# Altium schematic sheet MOTOR_CONTROL.SchDoc
size A2; SheetNumber: 13; SheetTotal: 16
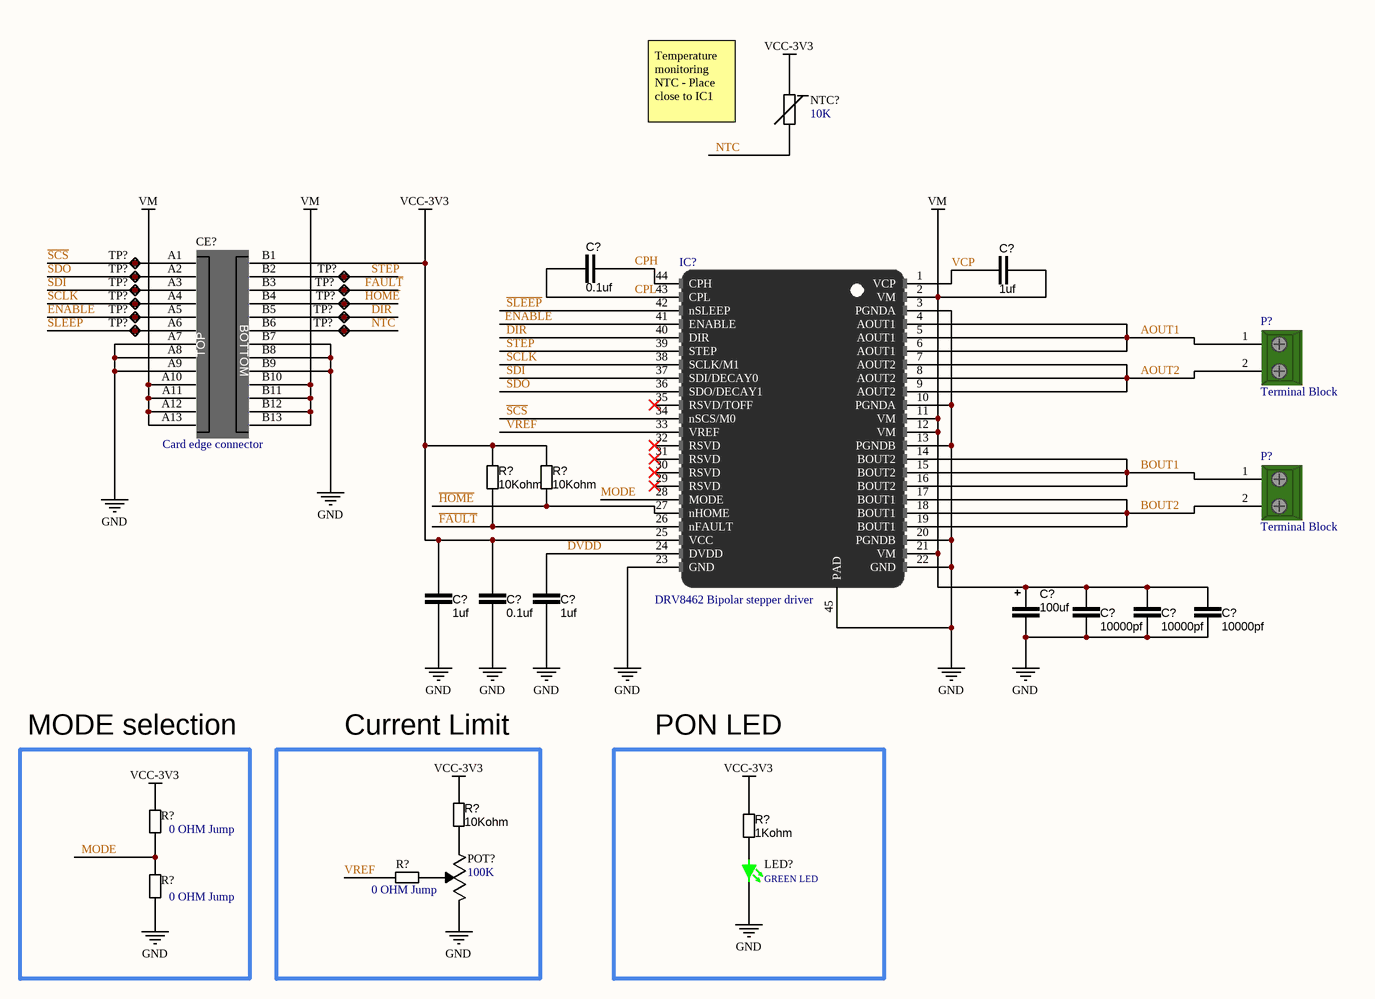
[diagram p0: MOTOR_CONTROL.SchDoc]

## Parts
(Parts that share a designator on the sheet are numbered #1, #2 ... from top to bottom, then left to right.)
C?#1  0.1uf  [CAP_0603]
C?#2  1uf  [CAP_0603]
C?#3  1uf  [CAP_0603]
C?#4  0.1uf  [CAP_0603]
C?#5  1uf  [CAP_0603]
C?#6  100uf  [CAPAE7366X60M]
C?#7  10000pf  [CAP_0603]
C?#8  10000pf  [CAP_0603]
C?#9  10000pf  [CAP_0603]
CE?  Card edge connector  [Edge Connector]
IC?  DRV8462 Bipolar stepper driver  [TSOP64P810X120_HS-45N]
LED?  GREEN LED  [DIOC1608X04N]
NTC?  10K  [SMD_0603]
P?#1  Terminal Block  [TERM_BLOCK 5mm 2PIN]
P?#2  Terminal Block  [TERM_BLOCK 5mm 2PIN]
POT?  100K  [TC33X-2_POT]
R?#1  10Kohm  [RES_0603]
R?#2  10Kohm  [RES_0603]
R?#3  10Kohm  [RES_0603]
R?#4  0 OHM Jump  [RES_0603]
R?#5  1Kohm  [RES_0603]
R?#6  0 OHM Jump  [RES_0603]
R?#7  0 OHM Jump  [RES_0603]
TP?#1  Test point  [TestPoint]  (value not drawn)
TP?#2  Test point  [TestPoint]  (value not drawn)
TP?#3  Test point  [TestPoint]  (value not drawn)
TP?#4  Test point  [TestPoint]  (value not drawn)
TP?#5  Test point  [TestPoint]  (value not drawn)
TP?#6  Test point  [TestPoint]  (value not drawn)
TP?#7  Test point  [TestPoint]  (value not drawn)
TP?#8  Test point  [TestPoint]  (value not drawn)
TP?#9  Test point  [TestPoint]  (value not drawn)
TP?#10  Test point  [TestPoint]  (value not drawn)
TP?#11  Test point  [TestPoint]  (value not drawn)

## Blocks framed on the sheet
MODE selection: R?#4 R?#7
Current Limit: POT? R?#3 R?#6
PON LED: LED? R?#5

## Nets
GND: C?#3.2 C?#4.1 C?#5.1 C?#6.1 C?#7.1 C?#8.1 C?#9.1 CE?.A7 CE?.A8 CE?.A9 CE?.B7 CE?.B8 CE?.B9 IC?.3(PGNDA) IC?.10(PGNDA) IC?.13(PGNDB) IC?.20(PGNDB) IC?.22(GND) IC?.23(GND) IC?.45(PAD) LED?.2 POT?.3 R?#7.1
VCC-3V3: C?#3.1 C?#4.2 CE?.B1 IC?.25(VCC) NTC?.2 R?#1.2 R?#2.2 R?#3.2 R?#4.2 R?#5.2
VM: C?#2.2 C?#6.2 C?#7.2 C?#8.2 C?#9.2 CE?.A10 CE?.A11 CE?.A12 CE?.A13 CE?.B10 CE?.B11 CE?.B12 CE?.B13 IC?.2(VM) IC?.11(VM) IC?.12(VM) IC?.21(VM)
~{FAULT}: CE?.B3 IC?.26(nFAULT) R?#1.1 TP?#5.1
~{HOME}: CE?.B4 IC?.27(nHOME) R?#2.1 TP?#7.1
~{SCS}: CE?.A1 IC?.34(nSCS/M0) TP?#1.1
~{SLEEP}: CE?.A6 IC?.42(nSLEEP) TP?#10.1
AOUT1: IC?.4(AOUT1) IC?.5(AOUT1) IC?.6(AOUT1) P?#1.1(pin1)
AOUT2: IC?.7(AOUT2) IC?.8(AOUT2) IC?.9(AOUT2) P?#1.2(pin2)
BOUT1: IC?.14(BOUT2) IC?.15(BOUT2) IC?.16(BOUT2) P?#2.1(pin1)
BOUT2: IC?.17(BOUT1) IC?.18(BOUT1) IC?.19(BOUT1) P?#2.2(pin2)
CPH: C?#1.2 IC?.44(CPH)
CPL: C?#1.1 IC?.43(CPL)
DIR: CE?.B5 IC?.40(DIR) TP?#9.1
DVDD: C?#5.2 IC?.24(DVDD)
ENABLE: CE?.A5 IC?.41(ENABLE) TP?#8.1
MODE: IC?.28(MODE) R?#4.1 R?#7.2
NTC: CE?.B6 NTC?.1 TP?#11.1
SCLK: CE?.A4 IC?.38(SCLK/M1) TP?#6.1
SDI: CE?.A3 IC?.37(SDI/DECAY0) TP?#4.1
SDO: CE?.A2 IC?.36(SDO/DECAY1) TP?#2.1
STEP: CE?.B2 IC?.39(STEP) TP?#3.1
VCP: C?#2.1 IC?.1(VCP)
VREF: IC?.33(VREF) R?#6.1
NetLED?_1: LED?.1 R?#5.1
NetPOT?_1: POT?.1 R?#3.1
NetPOT?_2: POT?.2 R?#6.2

Not connected (* = marked no-connect by the designer): IC? 29(RSVD)* 30(RSVD)* 31(RSVD)* 32(RSVD)* 35(RSVD/TOFF)*

## Notes on the sheet
- Temperature monitoring NTC - Place close to IC1
- (in symbol 00000007) BOTTOM; TOP

## Library data of the parts
C?#1 C?#4 = 0000012: CAP CER 0.1uF 10V X7R 0603; capaticanse: 0.1uf; ComponentLink1Description: digikey; ComponentLink1URL: https://www.digikey.com/en/products/detail/w%C3%BCrth-elektronik/885012206020/5453794; Digikey part number: 732-7939-2-ND
C?#2 C?#5 = 0000009: CAP CER 1uF 0603 16V X7R; capaticanse: 1uf; ComponentLink1Description: digikey; ComponentLink1URL: https://www.digikey.com/en/products/detail/samsung-electro-mechanics/CL10B105KO8NNNC/3886677; DigiKey part number: 1276-1019-2-ND
C?#3 = 0000011: CAP CER 1uF 10V X7R 0603; capaticanse: 1uf; ComponentLink1Description: digikey; ComponentLink1URL: https://www.digikey.com/en/products/detail/samsung-electro-mechanics/CL10B105KP8NNNC/3887604; DigiKey part number: 1276-1946-2-ND
C?#6 = 0000013: CAP ALUM POLY 100UF 20% 63V SMD; capaticanse: 100uf; ComponentLink1Description: digikey; ComponentLink1URL: https://www.digikey.com/en/products/detail/kemet/A767MU107M1JLAE028/7392906; DigiKey part number: 399-15648-2-ND
C?#7-C?#9 = 0000010: CAP CER 10000PF 63V X7R 0603; capaticanse: 10000pf; ComponentLink1Description: digikey; ComponentLink1URL: https://www.digikey.com/en/products/detail/knowles-syfer/060330630103KXT/6565244; Digikey part number: 1608-1294-2-ND
CE? = 00000007: Card edge connector 26 PINs
IC? = DRV8462: 65-V, 10-A, DUAL H-BRIDGE STEPPER DRIVER; Digikey part number: 296-DRV8462DDWRTR-ND; ComponentLink1Description: DigiKey; ComponentLink1URL: https://www.digikey.com/en/products/detail/texas-instruments/DRV8462DDWR/17395001?s=N4IgTCBcDaICYCcBuAOALANggXQL5A; Mouser part number: 595-DRV8462DDWR; ComponentLink2Description: Mouser; ComponentLink2URL: https://eu.mouser.com/ProductDetail/Texas-Instruments/DRV8462DDWR?qs=rQFj71Wb1eVexvYNsDfnvA%3D%3D; ComponentLink3Description: datasheet; ComponentLink3URL: https://www.ti.com/lit/ds/symlink/drv8462.pdf
LED? = 00000001: LED GREEN DIFFUSED 0603 SMD; Supplier 1: Avnet; Supplier Part Number 1: Q65111A3964; ComponentLink1Description: Digikey; ComponentLink1URL: https://www.digikey.com/en/products/detail/ams-osram-usa-inc/LG-Q396-PS-35/5249855
NTC? = 00000003: THERMISTOR NTC 10KOHM 3380K 0603; value: 10K; Supplier 1: Arrow Electronics; Supplier Part Number 1: NCP18XH103F03RB; ComponentLink1Description: Digikey; ComponentLink1URL: https://www.digikey.com/en/products/detail/murata-electronics/NCU18XH103F6SRB/7243451
P?#1 P?#2 = 00000001: Terminal block 90 deg 5mm 2PIN; ComponentLink1Description: DigiKey; ComponentLink1URL: https://www.digikey.com/en/products/detail/adam-tech/EB20-02-C/9831508; DigiKey part number: 2057-EB20-02-C-ND
POT? = 00000002: TRIMMER 100K OHM 0.1W J LEAD TOP; Supplier 1: Arrow Electronics; Supplier Part Number 1: TC33X-2-104E; ComponentLink1Description: DigiKey; ComponentLink1URL: https://www.digikey.com/en/products/detail/bourns-inc/TC33X-2-104E/612859; Value: 100K
R?#1-R?#3 = R000001: RES 10K OHM 1% 1/10W 0603; resistance: 10Kohm; ComponentLink1Description: digikey; ComponentLink1URL: https://www.digikey.com/en/products/detail/vishay-beyschlag-draloric-bc-components/MCT06030C1002FP500/1850440
R?#4 R?#6 R?#7 = R000007: RES 0 OHM JUMPER 1/10W 0603; Supplier 1: Arrow Electronics; Supplier Part Number 1: RMCF0603ZT0R00; ComponentLink1Description: DigiKey; ComponentLink1URL: https://www.digikey.com/en/products/detail/stackpole-electronics-inc/RMCF0603ZT0R00/1756908; resistance: 0 OHM Jump
R?#5 = R000004: RES 1K OHM 1% 1/10W 0603; resistance: 1Kohm; ComponentLink1Description: digikey; ComponentLink1URL: https://www.digikey.com/en/products/detail/vishay-beyschlag-draloric-bc-components/MCT06030C1001FP500/2607821
TP?#1-TP?#11 = TP002: Test point 1mm